# EAGLE design B0_DC12_DC51.1 (EAGLE 6.4)

## Sheet 1 of 2
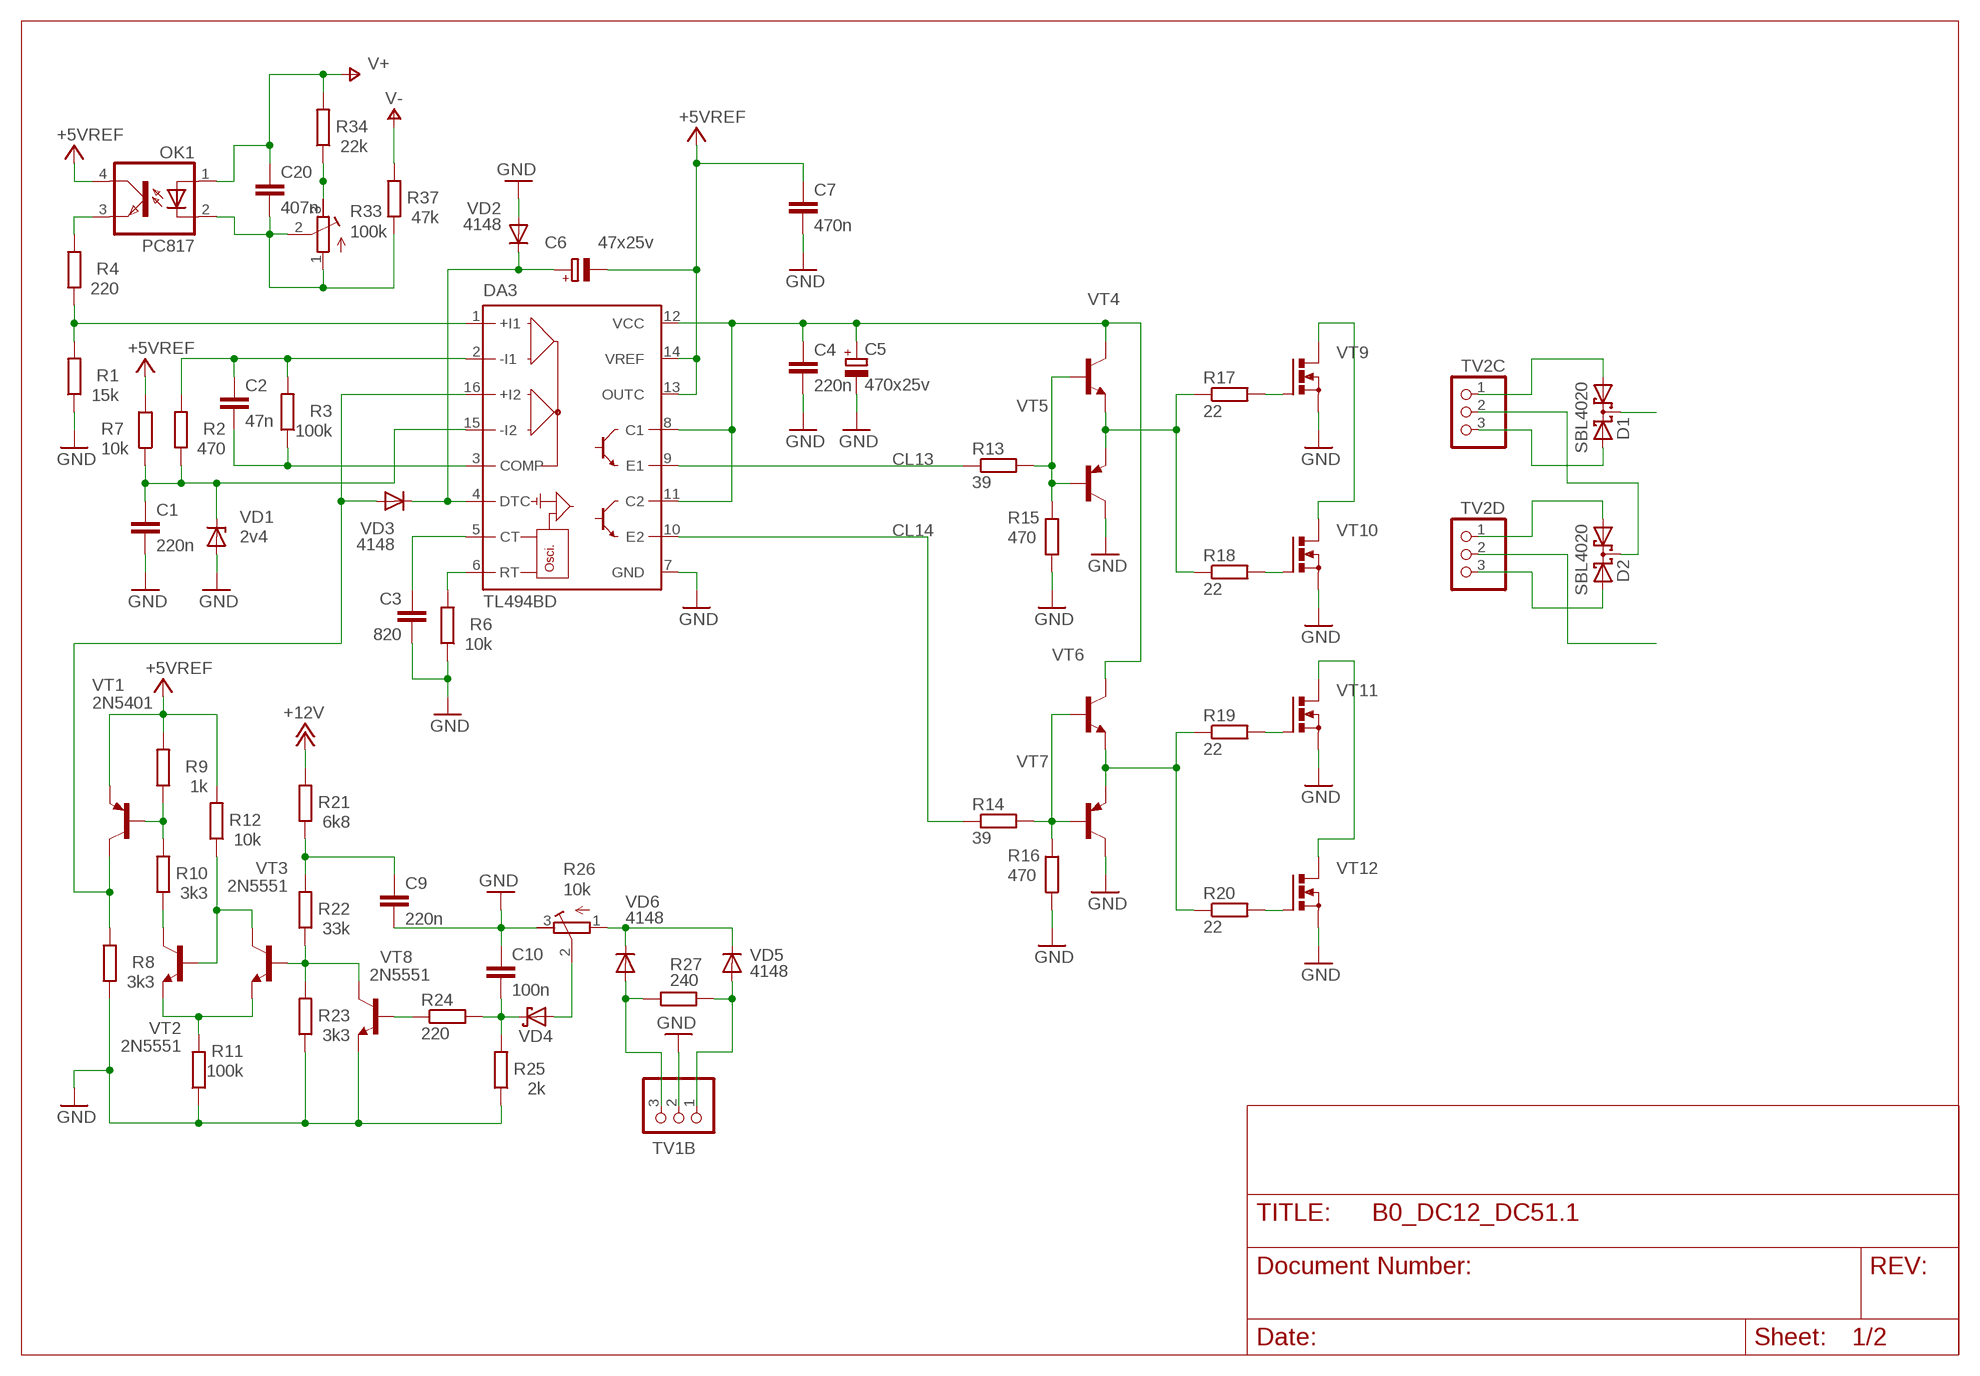
[diagram p0: schematic, sheet 1]

### Parts
C1  220n  C-EUC0805  [C0805]
C2  47n  C-EUC0805  [C0805]
C3  820  C-EU025-025X050  [C025-025X050]
C4  220n  C-EUC0805  [C0805]
C5  470x25v  CPOL-EUE5-10.5  [E5-10,5]
C6  47x25v  CPOL-EUE5-10.5  [E5-10,5]
C7  470n  C-EUC0805  [C0805]
C9  220n  C-EUC0805  [C0805]
C10  100n  C-EUC0805  [C0805]
C20  407n  C-EUC0805  [C0805]
D1  SBL4020  SCHOTTKY_DUALTO247H  [TO247H]
D2  SBL4020  SCHOTTKY_DUALTO247H  [TO247H]
DA3  TL494BD  [SO16]
OK1  PC817  [DIL04]
R1  15k  R-EU_M0805  [M0805]
R2  470  R-EU_M0805  [M0805]
R3  100k  R-EU_R0805  [R0805]
R4  220  R-EU_M0805  [M0805]
R6  10k  R-EU_0207/12  [0207/12]
R7  10k  R-EU_M0805  [M0805]
R8  3k3  R-EU_M0805  [M0805]
R9  1k  R-EU_M0805  [M0805]
R10  3k3  R-EU_M0805  [M0805]
R11  100k  R-EU_M0805  [M0805]
R12  10k  R-EU_M0805  [M0805]
R13  39  R-EU_M0805  [M0805]
R14  39  R-EU_M0805  [M0805]
R15  470  R-EU_M0805  [M0805]
R16  470  R-EU_M0805  [M0805]
R17  22  R-EU_M0805  [M0805]
R18  22  R-EU_M0805  [M0805]
R19  22  R-EU_M0805  [M0805]
R20  22  R-EU_M0805  [M0805]
R21  6k8  R-EU_M0805  [M0805]
R22  33k  R-EU_M0805  [M0805]
R23  3k3  R-EU_M0805  [M0805]
R24  220  R-EU_M0805  [M0805]
R25  2k  R-EU_M0805  [M0805]
R26  10k  R-TRIMM3296W  [RTRIM3296W]
R27  240  R-EU_0207/10  [0207/10]
R33  100k  R-TRIMM3296W  [RTRIM3296W]
R34  22k  R-EU_M0805  [M0805]
R37  47k  R-EU_M0805  [M0805]
TV1B  PINHD-1X3  [1X03]
TV2C  PINHD-1X3  [1X03]
TV2D  PINHD-1X3  [1X03]
VD1  2v4  ZENER-DIODESOD80C  [SOD80C]
VD2  4148  DIODE-SOD80C  [SOD80C]
VD3  4148  DIODE-SOD80C  [SOD80C]
VD4  1N5817-B  [DO41-7.6]
VD5  4148  DIODE-SOD80C  [SOD80C]
VD6  4148  DIODE-SOD80C  [SOD80C]
VT1  2N5401  BJT_PNP_TO-92_ECB  [TO92]
VT2  2N5551  BJT_NPN_TO-92_ECB  [TO92]
VT3  2N5551  BJT_NPN_TO-92_ECB  [TO92]
VT4  -NPN-TO126V  [TO126V]
VT5  -PNP-TO126V  [TO126V]
VT6  -NPN-TO126V  [TO126V]
VT7  -PNP-TO126V  [TO126V]
VT8  2N5551  BJT_NPN_TO-92_ECB  [TO92]
VT9  MOSFET-N_DPACK  [DPACK]
VT10  MOSFET-N_DPACK  [DPACK]
VT11  MOSFET-N_DPACK  [DPACK]
VT12  MOSFET-N_DPACK  [DPACK]

### Nets
+5VREF: C6.- C7.1 DA3.13(OUTC) DA3.14(VREF) OK1.4(COL) R7.2 R9.2 R12.2 VT1.1(E)
+12V: R21.2
CL13: DA3.9(E1) R13.1
CL14: DA3.10(E2) R14.1
GND: C1.2 C3.2 C4.2 C5.- C7.2 C9.2 C10.1 DA3.7(GND) R1.1 R6.1 R8.1 R11.1 R15.1 R16.1 R23.1 R25.1 R26.3(E) TV1B.2 VD1.A VD2.A VT5.2(C) VT7.2(C) VT8.1(E) VT9.S VT10.S VT11.S VT12.S
N$1: DA3.6(RT) R6.2
N$2: C3.1 DA3.5(CT)
N$3: VT9.D VT10.D
N$4: R17.2 VT9.G
N$5: R18.2 VT10.G
N$6: C2.2 DA3.3(COMP) R3.1
N$7: C1.1 DA3.15(-I2) R2.1 R7.1 VD1.C
N$8: R13.2 R15.2 VT4.3(B) VT5.3(B)
N$9: R17.1 R18.1 VT4.1(E) VT5.1(E)
N$10: R14.2 R16.2 VT6.3(B) VT7.3(B)
N$11: R19.1 R20.1 VT6.1(E) VT7.1(E)
N$12: VT11.D VT12.D
N$13: DA3.16(+I2) R8.2 VD3.A VT1.2(C)
N$14: OK1.3(EMIT) R4.2
N$15: C4.1 C5.+ DA3.8(C1) DA3.11(C2) DA3.12(VCC) VT4.2(C) VT6.2(C)
N$16: R27.2 TV1B.1 VD5.A
N$17: R19.2 VT11.G
N$18: R20.2 VT12.G
N$19: DA3.1(+I1) R1.2 R4.1
N$20: C6.+ DA3.4(DTC) VD2.C VD3.C
N$21: C20.2 OK1.2(C) R33.1(A) R33.2(S) R37.1
N$22: C2.1 DA3.2(-I1) R2.2 R3.2
N$23: R9.1 R10.2 VT1.3(B)
N$24: R33.3(E) R34.1
N$25: R27.1 TV1B.3 VD6.A
N$26: R10.1 VT2.2(C)
N$27: R12.1 VT2.3(B) VT3.2(C)
N$28: R11.2 VT2.1(E) VT3.1(E)
N$29: R22.1 R23.2 VT3.3(B) VT8.2(C)
N$30: C9.1 R21.1 R22.2
N$31: R24.1 VT8.3(B)
N$32: C10.2 R24.2 R25.2 VD4.C
N$33: R26.2(S) VD4.A
N$34: R26.1(A) VD5.C VD6.C
N$35: D1.1(A1) TV2C.1
N$36: D1.3(A2) TV2C.3
N$37: D2.1(A1) TV2D.1
N$38: D2.3(A2) TV2D.3
N$39: D1.2(C)
N$40: D2.2(C) TV2C.2
N$41: TV2D.2
V+: C20.1 OK1.1(A) R34.2
V-: R37.2

## Sheet 2 of 2
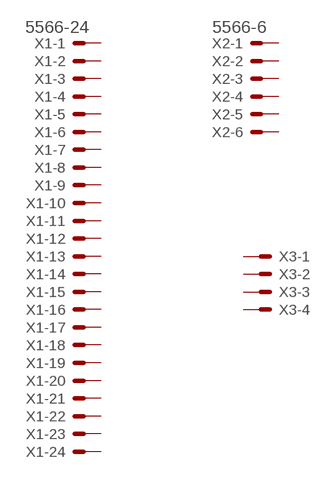
[diagram p1: schematic, sheet 2]

### Parts
X1  5566-24  [5566-24]
X2  5566-6  [5566-6]
X3  KK-156-4  [KK-156-4]
Unconnected: X1.1 X1.2 X1.3 X1.4 X1.5 X1.6 X1.7 X1.8 X1.9 X1.10 X1.11 X1.12 X1.13 X1.14 X1.15 X1.16 X1.17 X1.18 X1.19 X1.20 X1.21 X1.22 X1.23 X1.24 X2.1 X2.2 X2.3 X2.4 X2.5 X2.6 X3.1 X3.2 X3.3 X3.4

## Library data of the parts
C1-C4 C7 C9 C10 C20 = rcl:C-EU: CAPACITOR, European symbol
C5 C6 = rcl:CPOL-EU: POLARIZED CAPACITOR, European symbol
D1 D2 = diodes:SCHOTTKY_DUAL: Silicon Schottky Diodes TO-220 SBL2040CT TO-247 SBL3040PT
DA3 = linear:TL494*: SWITCHMODE Pulse Width Modulation Control Circuit NCV494B http://onsemi.com tl494-d.pdf
OK1 = optocoupler:PC817: SHARP OPTO COUPLER; MPN: PC817X4J000F; OC_FARNELL: 9707727; OC_NEWARK: 97K7059
R1-R4 R6-R25 R27 R34 R37 = rcl:R-EU_: RESISTOR, European symbol
R26 R33 = rcl:R-TRIMM: Trimm resistor
TV1B TV2C TV2D = Разъёмы штырьковые 2.54мм:PINHD-1X3: PIN HEADER
VD1 = diode:ZENER-DIODE: Z-Diode
VD2 VD3 VD5 VD6 = diode:DIODE-: DIODE
VD4 = diode:1N581*: 1.0A SCHOTTKY BARRIER RECTIFIER Source: http://www.diodes.com/datasheets/ds23001.pdf
VT1 = m_transistor:BJT_PNP: PNP Transistror КТ3107* CBE BD138 ECB BC847 SOT23 BCE
VT2 VT3 VT8 = m_transistor:BJT_NPN: NPN Transistor 13005 TO-220 BCE КТ805 TO-220 ECB КТ3102*М TO-92 CBE МП37 ТО-5 BC847 SOT23 BCE
VT4 VT6 = transistor:*-NPN-: NPN Transistror BF959 corrected 2008.03.06
VT5 VT7 = transistor:*-PNP-: PNP Transistror
VT9-VT12 = m_transistor:MOSFET-N: MOSFET N-Channel
X1 = con-molex:5566-24: Mini FIT connector 24 pol Source: http://www.molex.com; OC_FARNELL: unknown; OC_NEWARK: unknown
X2 = con-molex:5566-6: Mini FIT connector 6 pol Source: http://www.molex.com; MPN: 95566-61002; OC_FARNELL: unknown; OC_NEWARK: 22K8620
X3 = con-molex:KK-156-4: KK 156 HEADER Source: http://www.molex.com/pdm_docs/sd/026604100_sd.pdf; OC_FARNELL: unknown; OC_NEWARK: unknown

## Board
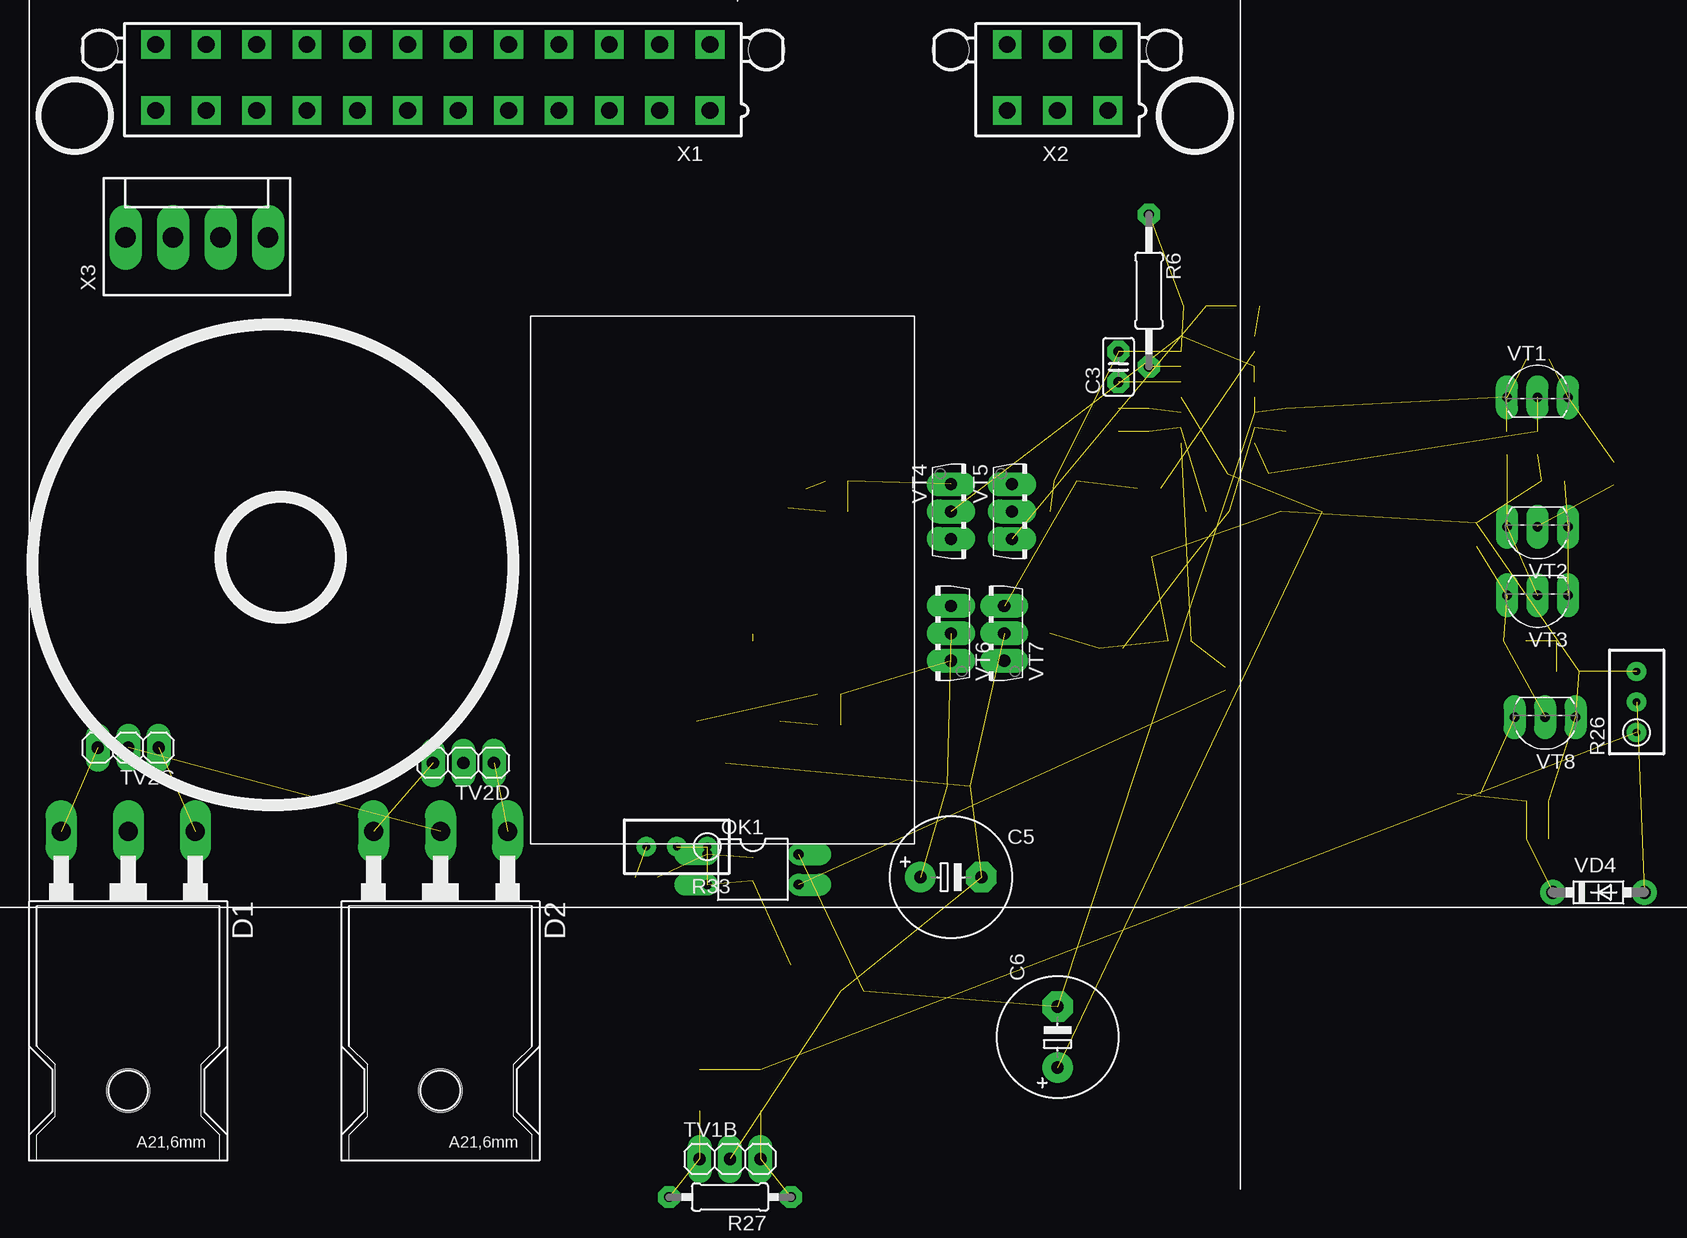
[diagram p2: board, top side]
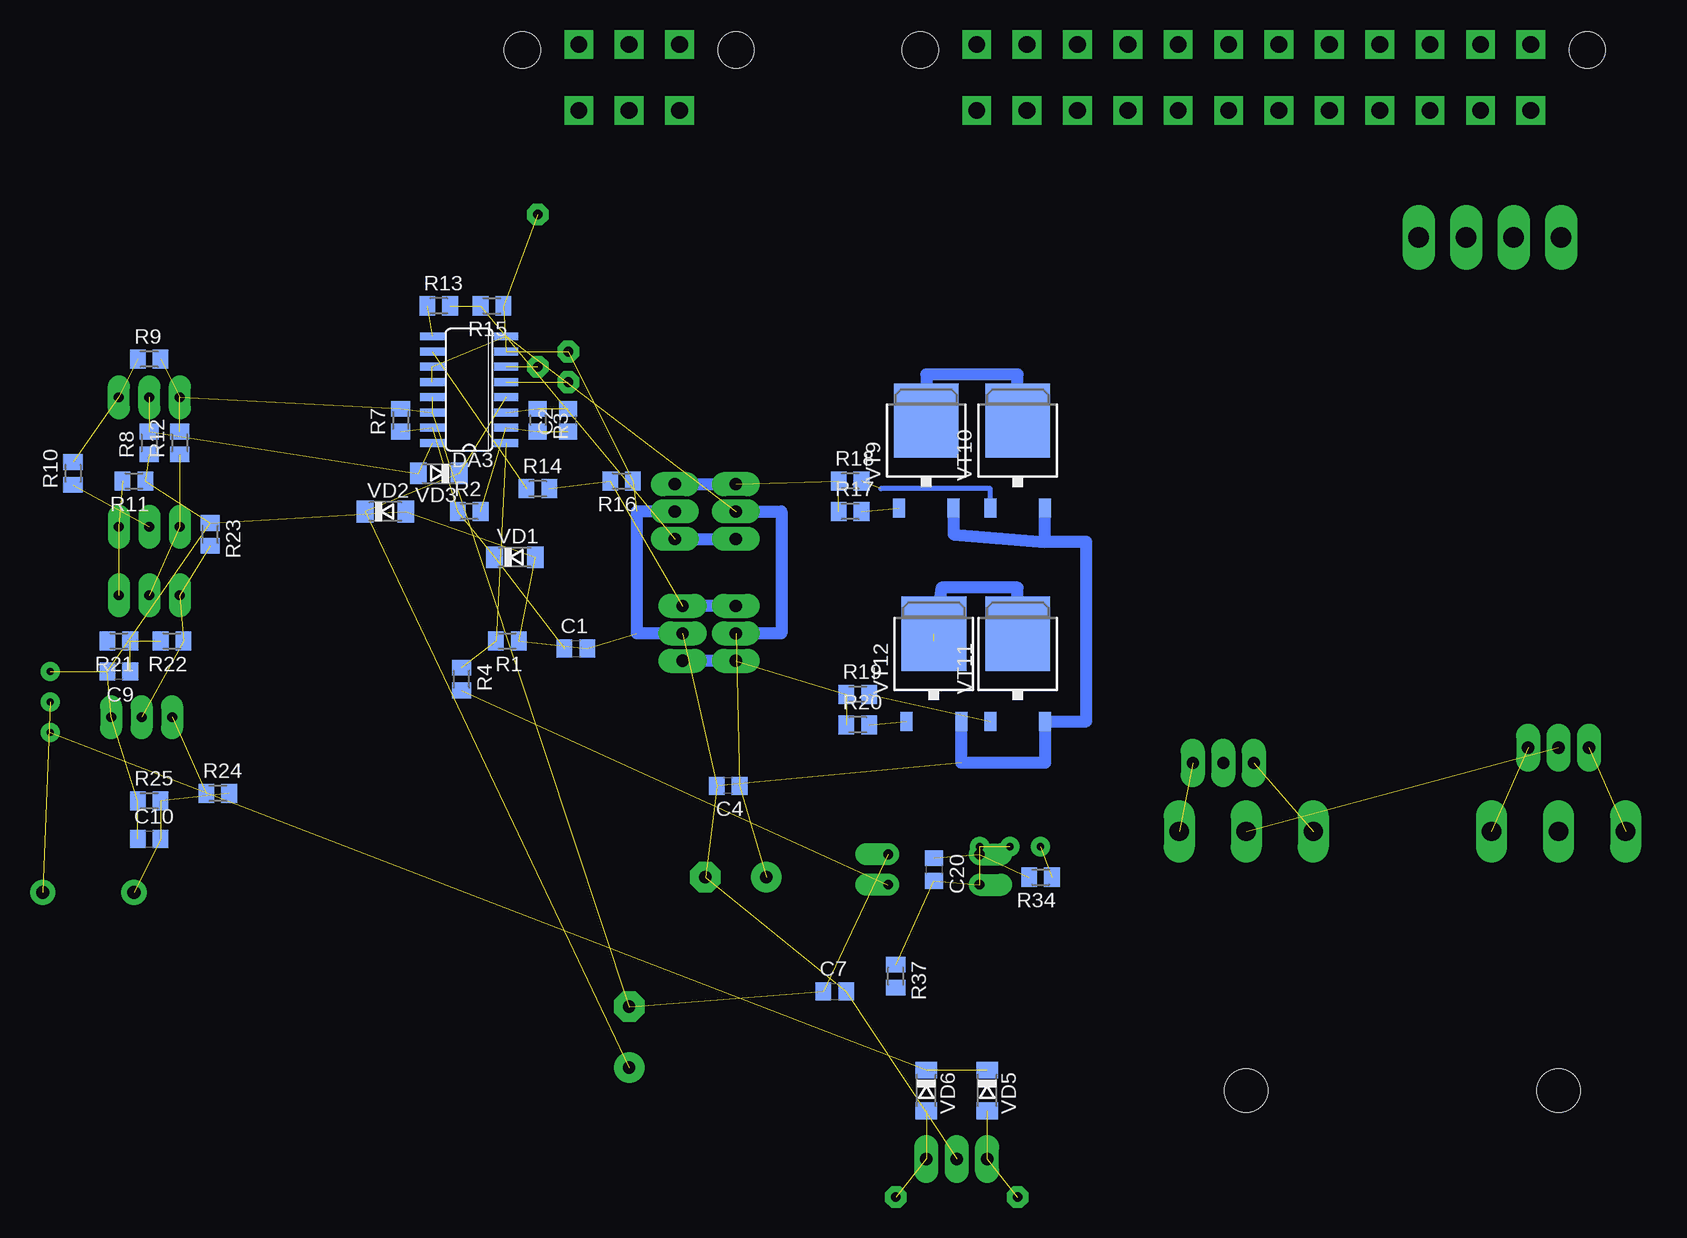
[diagram p3: board, bottom side, seen from below]

No outline drawn. Coordinates in mm, seen from the top.
Copper layers (1*16): Top 0.035mm / dielectric 1.5mm / Bottom 0.035mm
Design rules "DesignRules": minimum track width 8mil, minimum drill 24mil, track to track 0.2mm, track to pad 0.2mm, pad to pad 8mil, via to via 8mil, smd to smd 8mil, copper to edge 10mil, drill to drill 8mil, minimum pad ring 0.5mm, minimum via ring 8mil, stop-mask expansion 4mil, vias tented up to drill 0mil, thermal gap 10mil

### Footprints (pad centres in the part's own frame; a part is rotated, then mirrored left to right if it is on the bottom)
C0805 = smd 1.3 x 1.5: 1 -0.95,0; 2 0.95,0
C025-025X050 = drill 0.813 octagon: 1 -1.27,0; 2 1.27,0
E5-10,5 = drill 1.016 pad 2.54: + -2.54,0 | drill 1.016 pad 2.54 octagon: - 2.54,0
TO247H = drill 1.6 long: 1 -5.588,-7.62; 2 0,-7.62; 3 5.588,-7.62 | hole 3.607: 0,13.97
SO16 = smd 0.66 x 2.032: 1 -4.445,-3.073; 2 -3.175,-3.073; 3 -1.905,-3.073; 4 -0.635,-3.073; 5 0.635,-3.073; 6 1.905,-3.073; 7 3.175,-3.073; 8 4.445,-3.073; 9 4.445,3.073; 10 3.175,3.073; 11 1.905,3.073; 12 0.635,3.073; 13 -0.635,3.073; 14 -1.905,3.073; 15 -3.175,3.073; 16 -4.445,3.073
DIL04 = drill 0.813 offset: 1 -1.27,-3.81; 2 1.27,-3.81; 3 1.27,3.81; 4 -1.27,3.81
M0805 = smd 1.3 x 1.6: 1 -0.95,0; 2 0.95,0
R0805 = smd 1.3 x 1.5: 1 -0.95,0; 2 0.95,0
0207/12 = drill 0.813 octagon: 1 -6.35,0; 2 6.35,0
RTRIM3296W = drill 0.61: 1 0,-2.54; 2 0,0; 3 0,2.54
0207/10 = drill 0.813 octagon: 1 -5.08,0; 2 5.08,0
1X03 = drill 1.016 long: 1 -2.54,0; 2 0,0; 3 2.54,0
SOD80C = smd 1.4 x 1.8: A 1.7,0; C -1.7,0
DO41-7.6 = drill 1.1 pad 1.7: A 3.81,0; C -3.81,0
TO92 = drill 0.813 long: 1 -2.54,-1.27; 2 0,-1.27; 3 2.54,-1.27
TO126V = drill 1.016 long: 1 -2.286,-1.27; 2 0,-1.27; 3 2.286,-1.27
DPACK = smd 5.4 x 6.2: D 0,2.5 | smd 1 x 1.6: G -2.28,-4.8; S 2.28,-4.8
5566-24 = drill 1.4 square: 1 23.1,-2.75; 2 18.9,-2.75; 3 14.7,-2.75; 4 10.5,-2.75; 5 6.3,-2.75; 6 2.1,-2.75; 7 -2.1,-2.75; 8 -6.3,-2.75; 9 -10.5,-2.75; 10 -14.7,-2.75; 11 -18.9,-2.75; 12 -23.1,-2.75; 13 23.1,2.75; 14 18.9,2.75; 15 14.7,2.75; 16 10.5,2.75; 17 6.3,2.75; 18 2.1,2.75; 19 -2.1,2.75; 20 -6.3,2.75; 21 -10.5,2.75; 22 -14.7,2.75; 23 -18.9,2.75; 24 -23.1,2.75 | hole 3: 27.8,2.29; -27.8,2.29
5566-6 = drill 1.4 square: 1 4.2,-2.75; 2 0,-2.75; 3 -4.2,-2.75; 4 4.2,2.75; 5 0,2.75; 6 -4.2,2.75 | hole 3: 8.9,2.29; -8.9,2.29
KK-156-4 = drill 1.7 pad 2.184 long: 1 -5.94,0; 2 -1.98,0; 3 1.98,0; 4 5.94,0

### Placement (x,y rotation side)
C1  -55.24,-12.7 0 bottom
C2  -54.61,6.35 90 bottom
C3  -54.61,10.79 90 top
C4  -67.94,-24.13 180 bottom
C5  -68.58,-31.75 0 top
C6  -59.69,-45.09 90 top
C7  -76.83,-41.27 0 bottom
C9  -17.14,-14.61 180 bottom
C10  -19.68,-28.57 0 bottom
C20  -85.09,-31.11 270 bottom
D1  -137.16,-35.56 180 top
D2  -111.12,-35.56 180 top
DA3  -46.35,8.89 90 bottom
OK1  -85.09,-31.11 270 top
R1  -49.53,-12.06 180 bottom
R2  -46.35,-1.27 0 bottom
R3  -52.07,6.35 270 bottom
R4  -45.72,-15.24 270 bottom
R6  -52.07,17.14 270 top
R7  -40.64,6.35 90 bottom
R8  -19.68,4.45 90 bottom
R9  -19.68,11.43 0 bottom
R10  -13.34,1.91 90 bottom
R11  -18.41,1.27 180 bottom
R12  -22.23,4.45 90 bottom
R13  -43.81,15.88 0 bottom
R14  -52.07,0.64 0 bottom
R15  -48.26,15.88 180 bottom
R16  -59.05,1.27 180 bottom
R17  -78.11,-1.27 0 bottom
R18  -78.11,1.27 0 bottom
R19  -78.74,-16.51 0 bottom
R20  -78.74,-19.05 0 bottom
R21  -17.14,-12.06 180 bottom
R22  -21.59,-12.06 180 bottom
R23  -24.77,-3.17 270 bottom
R24  -25.4,-24.77 0 bottom
R25  -19.68,-25.4 0 bottom
R26  -11.43,-17.14 0 top
R27  -87,-58.42 180 top
R33  -91.44,-29.21 90 top
R34  -93.98,-31.75 180 bottom
R37  -81.92,-40.01 270 bottom
TV1B  -87,-55.24 0 top
TV2C  -137.16,-20.95 180 top
TV2D  -109.22,-22.23 180 top
U$1  [H44X32]  -87.63,-6.99 90 top
VD1  -50.16,-5.08 0 bottom
VD2  -39.37,-1.27 0 bottom
VD3  -43.81,1.91 180 bottom
VD4  -14.61,-33.02 0 top
VD5  -89.53,-49.53 270 bottom
VD6  -84.45,-49.53 270 bottom
VT1  -19.68,9.53 0 top
VT2  -19.68,-3.81 180 top
VT3  -19.68,-9.53 180 top
VT4  -67.31,-1.27 270 top
VT5  -62.23,-1.27 270 top
VT6  -69.85,-11.43 90 top
VT7  -65.41,-11.43 90 top
VT8  -19.05,-19.68 180 top
VT9  -84.45,3.81 0 bottom
VT10  -92.08,3.81 0 bottom
VT11  -92.08,-13.97 0 bottom
VT12  -85.09,-13.97 0 bottom
X1  -111.76,34.92 0 top
X2  -59.69,34.92 0 top
X3  -131.44,21.59 0 top

### Tracks (layer width: path | path; a pad name or v marks a point on that pad's centre or on a via)
+5VREF  (8 unrouted)
CL13  (1 unrouted)
CL14  (1 unrouted)
GND  (22 unrouted)
  Bottom 1.016: VT9.S -86.73,-3.17 -94.36,-3.81 | -94.36,-3.81 VT10.S | VT12.S -87.37,-22.23 -94.36,-22.23 VT11.S -97.79,-18.77 -97.79,-3.81 -94.36,-3.81 | VT5.2 -60.33,-1.27 -60.33,-11.43 VT7.2
N$1  (1 unrouted)
N$2  (1 unrouted)
N$3
  Bottom 1.016: VT10.D -92.08,10.16 -84.45,10.16 VT9.D
N$4  (1 unrouted)
N$5  (1 unrouted)
  Bottom 0.406: VT10.G -89.8,0.64 -80.64,0.64
N$6  (2 unrouted)
N$7  (4 unrouted)
N$8  (2 unrouted)
  Bottom 1.016: VT5.3 VT4.3
N$9  (2 unrouted)
  Bottom 1.016: VT5.1 VT4.1
N$10  (2 unrouted)
  Bottom 1.016: VT6.3 VT7.3
N$11  (2 unrouted)
  Bottom 1.016: VT6.1 VT7.1
N$12  (1 unrouted)
  Bottom 1.016: VT11.D -92.08,-7.62 -85.72,-7.62 -85.09,-12.06
N$13  (3 unrouted)
N$14  (1 unrouted)
N$15  (5 unrouted)
  Bottom 1.016: VT4.2 -72.39,-1.27 -72.39,-11.43 VT6.2
N$16  (2 unrouted)
N$17  (1 unrouted)
N$18  (1 unrouted)
N$19  (2 unrouted)
N$20  (3 unrouted)
N$21  (4 unrouted)
N$22  (3 unrouted)
N$23  (2 unrouted)
N$24  (1 unrouted)
N$25  (2 unrouted)
N$26  (1 unrouted)
N$27  (2 unrouted)
N$28  (2 unrouted)
N$29  (3 unrouted)
N$30  (2 unrouted)
N$31  (1 unrouted)
N$32  (3 unrouted)
N$33  (1 unrouted)
N$34  (2 unrouted)
N$35  (1 unrouted)
N$36  (1 unrouted)
N$37  (1 unrouted)
N$38  (1 unrouted)
N$40  (1 unrouted)
V+  (2 unrouted)